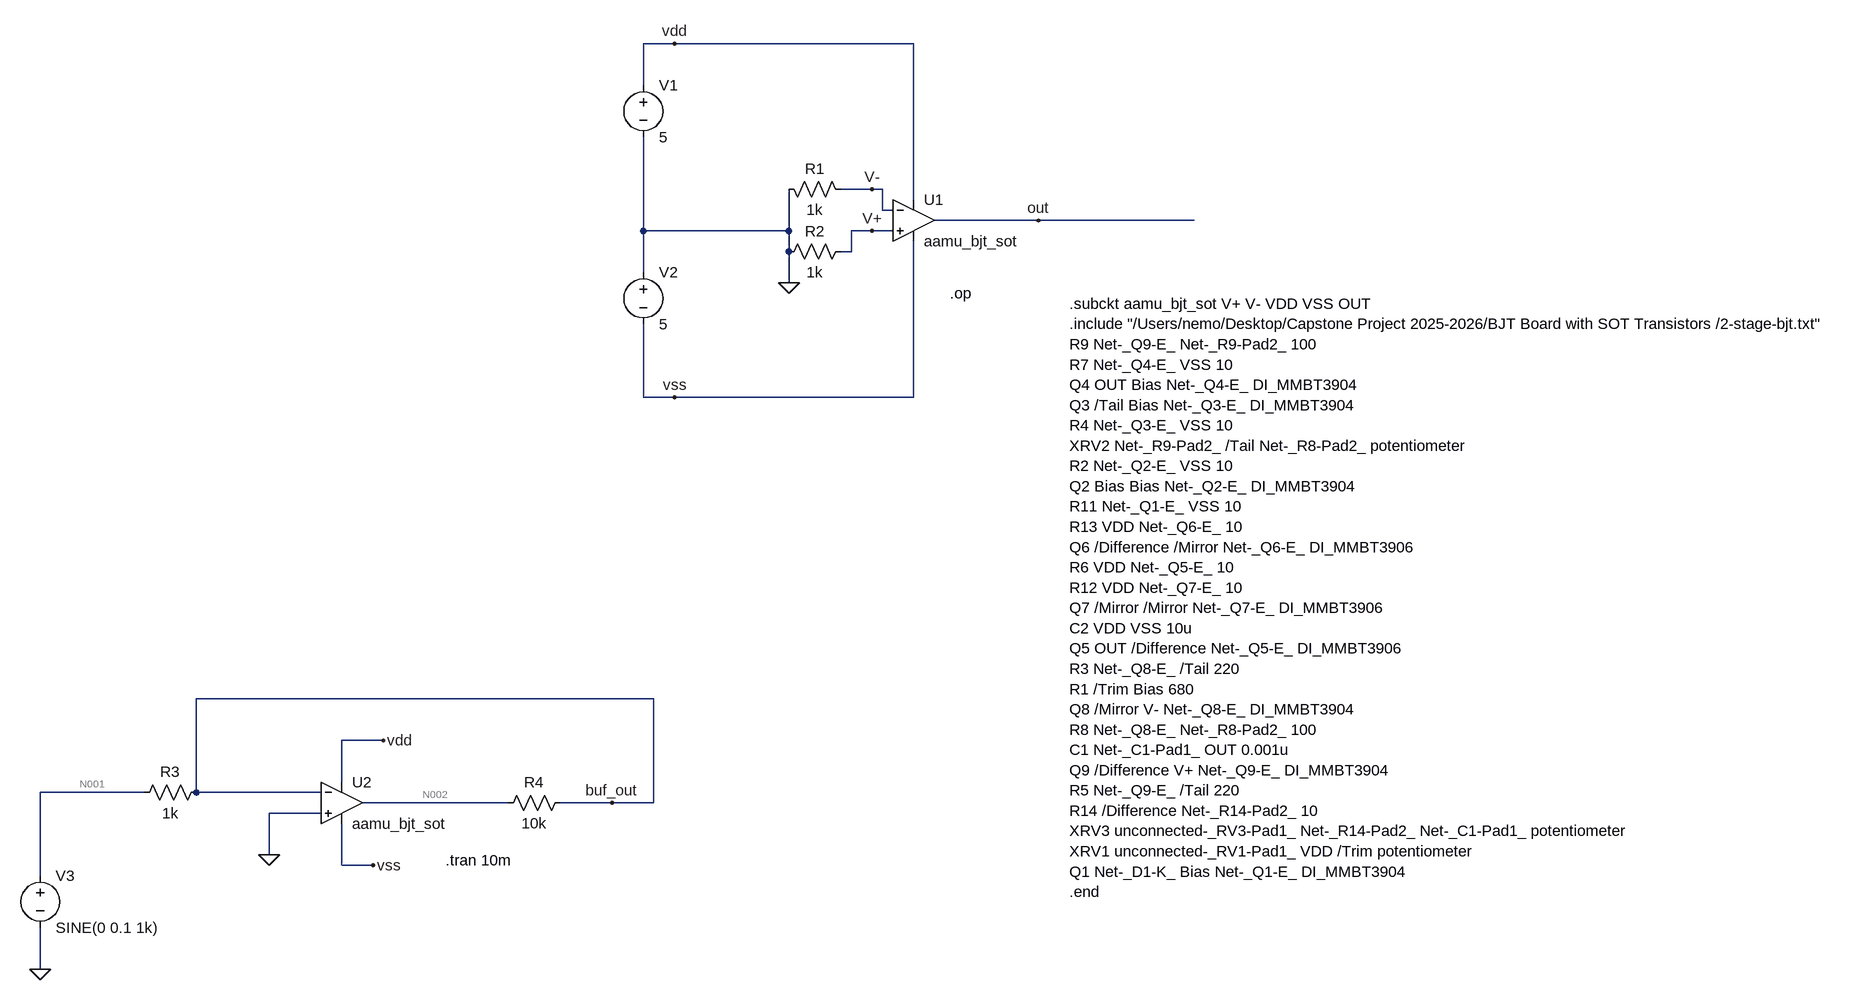
[diagram p0: schematic BJT-OpAmp-SOT-Transistors copy.asc]
BJT-OpAmp-SOT-Transistors copy.asc, the LTspice schematic file:
Version 4
SHEET 1 1828 1676
WIRE 16 -16 -32 -16
WIRE 384 -16 16 -16
WIRE -32 48 -32 -16
WIRE 320 208 272 208
WIRE 336 208 320 208
WIRE 384 224 384 -16
WIRE 336 240 336 208
WIRE 352 240 336 240
WIRE 576 256 416 256
WIRE 816 256 576 256
WIRE -32 272 -32 128
WIRE 192 272 192 208
WIRE 192 272 -32 272
WIRE 320 272 288 272
WIRE 352 272 320 272
WIRE 192 304 192 272
WIRE 288 304 288 272
WIRE 288 304 272 304
WIRE -32 336 -32 272
WIRE 192 352 192 304
WIRE -32 528 -32 416
WIRE 16 528 -32 528
WIRE 384 528 384 288
WIRE 384 528 16 528
WIRE -16 992 -720 992
WIRE -432 1056 -496 1056
WIRE -496 1120 -496 1056
WIRE -800 1136 -960 1136
WIRE -720 1136 -720 992
WIRE -528 1136 -720 1136
WIRE -240 1152 -464 1152
WIRE -80 1152 -160 1152
WIRE -16 1152 -16 992
WIRE -16 1152 -80 1152
WIRE -528 1168 -608 1168
WIRE -608 1232 -608 1168
WIRE -496 1248 -496 1184
WIRE -448 1248 -496 1248
WIRE -960 1264 -960 1136
WIRE -960 1408 -960 1344
FLAG 192 352 0
FLAG 576 256 out
FLAG 16 -16 vdd
FLAG 16 528 vss
FLAG 320 272 V+
FLAG 320 208 V-
FLAG -608 1232 0
FLAG -960 1408 0
FLAG -80 1152 buf_out
FLAG -432 1056 vdd
FLAG -448 1248 vss
DATAFLAG 240 -16 "$"
DATAFLAG 272 528 "$"
DATAFLAG 720 256 "$"
SYMBOL res 288 224 M270
WINDOW 0 32 56 VTop 2
WINDOW 3 0 56 VBottom 2
SYMATTR InstName R1
SYMATTR Value 1k
SYMBOL Res 288 288 R90
WINDOW 0 0 56 VBottom 2
WINDOW 3 32 56 VTop 2
SYMATTR InstName R2
SYMATTR Value 1k
SYMBOL voltage -32 32 R0
SYMATTR InstName V1
SYMATTR Value 5
SYMBOL voltage -32 320 R0
SYMATTR InstName V2
SYMATTR Value 5
SYMBOL OpAmps/opamp2 384 192 R0
SYMATTR InstName U1
SYMATTR Value aamu_bjt_sot
SYMBOL OpAmps/opamp2 -496 1088 R0
SYMATTR InstName U2
SYMATTR Value aamu_bjt_sot
SYMBOL res -704 1120 R90
WINDOW 0 0 56 VBottom 2
WINDOW 3 32 56 VTop 2
SYMATTR InstName R3
SYMATTR Value 1k
SYMBOL res -144 1136 R90
WINDOW 0 0 56 VBottom 2
WINDOW 3 32 56 VTop 2
SYMATTR InstName R4
SYMATTR Value 10k
SYMBOL voltage -960 1248 R0
SYMATTR InstName V3
SYMATTR Value SINE(0 0.1 1k)
TEXT 440 368 Left 2 !.op
TEXT 624 384 Left 2 !.subckt aamu_bjt_sot V+ V- VDD VSS OUT\n.include "/Users/nemo/Desktop/Capstone Project 2025-2026/BJT Board with SOT Transistors /2-stage-bjt.txt"\nR9 Net-_Q9-E_ Net-_R9-Pad2_ 100\nR7 Net-_Q4-E_ VSS 10\nQ4 OUT Bias Net-_Q4-E_ DI_MMBT3904\nQ3 /Tail Bias Net-_Q3-E_ DI_MMBT3904\nR4 Net-_Q3-E_ VSS 10\nXRV2 Net-_R9-Pad2_ /Tail Net-_R8-Pad2_ potentiometer\nR2 Net-_Q2-E_ VSS 10\nQ2 Bias Bias Net-_Q2-E_ DI_MMBT3904\nR11 Net-_Q1-E_ VSS 10\nR13 VDD Net-_Q6-E_ 10\nQ6 /Difference /Mirror Net-_Q6-E_ DI_MMBT3906\nR6 VDD Net-_Q5-E_ 10\nR12 VDD Net-_Q7-E_ 10\nQ7 /Mirror /Mirror Net-_Q7-E_ DI_MMBT3906\nC2 VDD VSS 10u\nQ5 OUT /Difference Net-_Q5-E_ DI_MMBT3906\nR3 Net-_Q8-E_ /Tail 220\nR1 /Trim Bias 680\nQ8 /Mirror V- Net-_Q8-E_ DI_MMBT3904\nR8 Net-_Q8-E_ Net-_R8-Pad2_ 100\nC1 Net-_C1-Pad1_ OUT 0.001u\nQ9 /Difference V+ Net-_Q9-E_ DI_MMBT3904\nR5 Net-_Q9-E_ /Tail 220\nR14 /Difference Net-_R14-Pad2_ 10\nXRV3 unconnected-_RV3-Pad1_ Net-_R14-Pad2_ Net-_C1-Pad1_ potentiometer\nXRV1 unconnected-_RV1-Pad1_ VDD /Trim potentiometer\nQ1 Net-_D1-K_ Bias Net-_Q1-E_ DI_MMBT3904\n.end
TEXT -336 1240 Left 2 !.tran 10m

The netlist it stands for:
* BJT-OpAmp-SOT-Transistors copy.asc
R1 V- 0 1k
R2 V+ 0 1k
V1 vdd 0 5
V2 0 vss 5
XU1 V+ V- vdd vss out aamu_bjt_sot  ; pins In+ In- V+ V- OUT
XU2 0 buf_out vdd vss N002 aamu_bjt_sot  ; pins In+ In- V+ V- OUT
R3 buf_out N001 1k
R4 buf_out N002 10k
V3 N001 0 SINE(0 0.1 1k)
.op
.subckt aamu_bjt_sot V+ V- VDD VSS OUT
.include "/Users/nemo/Desktop/Capstone Project 2025-2026/BJT Board with SOT Transistors /2-stage-bjt.txt"
R9 Net-_Q9-E_ Net-_R9-Pad2_ 100
R7 Net-_Q4-E_ VSS 10
Q4 OUT Bias Net-_Q4-E_ DI_MMBT3904
Q3 /Tail Bias Net-_Q3-E_ DI_MMBT3904
R4 Net-_Q3-E_ VSS 10
XRV2 Net-_R9-Pad2_ /Tail Net-_R8-Pad2_ potentiometer
R2 Net-_Q2-E_ VSS 10
Q2 Bias Bias Net-_Q2-E_ DI_MMBT3904
R11 Net-_Q1-E_ VSS 10
R13 VDD Net-_Q6-E_ 10
Q6 /Difference /Mirror Net-_Q6-E_ DI_MMBT3906
R6 VDD Net-_Q5-E_ 10
R12 VDD Net-_Q7-E_ 10
Q7 /Mirror /Mirror Net-_Q7-E_ DI_MMBT3906
C2 VDD VSS 10u
Q5 OUT /Difference Net-_Q5-E_ DI_MMBT3906
R3 Net-_Q8-E_ /Tail 220
R1 /Trim Bias 680
Q8 /Mirror V- Net-_Q8-E_ DI_MMBT3904
R8 Net-_Q8-E_ Net-_R8-Pad2_ 100
C1 Net-_C1-Pad1_ OUT 0.001u
Q9 /Difference V+ Net-_Q9-E_ DI_MMBT3904
R5 Net-_Q9-E_ /Tail 220
R14 /Difference Net-_R14-Pad2_ 10
XRV3 unconnected-_RV3-Pad1_ Net-_R14-Pad2_ Net-_C1-Pad1_ potentiometer
XRV1 unconnected-_RV1-Pad1_ VDD /Trim potentiometer
Q1 Net-_D1-K_ Bias Net-_Q1-E_ DI_MMBT3904
.end
.tran 10m
.backanno
.end

* Results of the author's LTspice run, read from the files saved beside the schematic
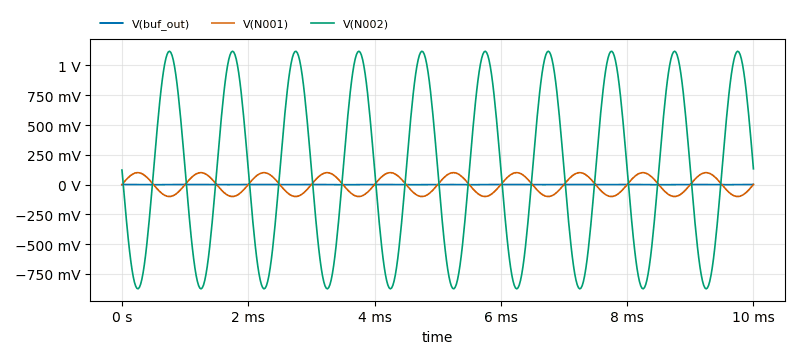
[diagram p1: Transient Analysis of BJT-OpAmp-SOT-Transistors copy.asc, plotted from the saved traces]
* Transient Analysis, 1 run:
*   V(buf_out): min -851.4 µV, max 1.05 mV, average 98.23 µV, rms 679.2 µV, last 1.03 mV
*   V(N001): min -100 mV, max 100 mV, average 3.236 µV, rms 70.7 mV, last 0 V
*   V(N002): min -874.8 mV, max 1.119 V, average 122.1 mV, rms 715.4 mV, last 132.5 mV